# Altium project MICA-Glove-Carpus.PrjPcb
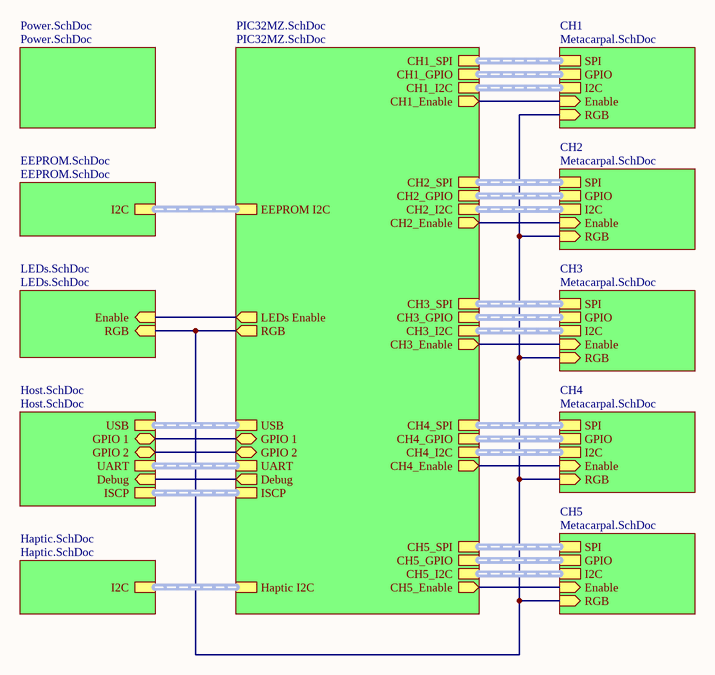
[diagram p0: Main.SchDoc]
Author: Seb Madgwick; Project: MICA Glove Carpus; Version: v1.0
8 sheets, 72 parts. Net scope: hierarchical (ports join the sheet entries above them; power ports are global).
Board file: MICA-Glove-Carpus.PcbDoc
Sheets:
  Main.SchDoc
    PIC32MZ.SchDoc = PIC32MZ.SchDoc
    Power.SchDoc = Power.SchDoc
    CH1 = Metacarpal.SchDoc
    EEPROM.SchDoc = EEPROM.SchDoc
    LEDs.SchDoc = LEDs.SchDoc
    Haptic.SchDoc = Haptic.SchDoc
    Host.SchDoc = Host.SchDoc
    CH2 = Metacarpal.SchDoc
    CH3 = Metacarpal.SchDoc
    CH4 = Metacarpal.SchDoc
    CH5 = Metacarpal.SchDoc

## Sheet Main.SchDoc
size A4; SheetNumber: 1; SheetTotal: 8

### Sub-sheets
CH1 = Metacarpal.SchDoc: I2C (harness I2C), SPI (harness SPI), GPIO (harness GPIO), RGB (in), Enable (in)
CH2 = Metacarpal.SchDoc: I2C (harness I2C), SPI (harness SPI), GPIO (harness GPIO), RGB (in), Enable (in)
CH3 = Metacarpal.SchDoc: I2C (harness I2C), SPI (harness SPI), GPIO (harness GPIO), RGB (in), Enable (in)
CH4 = Metacarpal.SchDoc: I2C (harness I2C), SPI (harness SPI), GPIO (harness GPIO), RGB (in), Enable (in)
CH5 = Metacarpal.SchDoc: I2C (harness I2C), SPI (harness SPI), GPIO (harness GPIO), RGB (in), Enable (in)
EEPROM.SchDoc = EEPROM.SchDoc: I2C (harness I2C)
Haptic.SchDoc = Haptic.SchDoc: I2C (harness I2C)
Host.SchDoc = Host.SchDoc: UART (harness UART), USB (harness USB), ISCP (harness ICSP), Debug (in), GPIO 1 (bidir), GPIO 2 (bidir)
LEDs.SchDoc = LEDs.SchDoc: RGB (in), Enable (in)
PIC32MZ.SchDoc = PIC32MZ.SchDoc: EEPROM I2C (harness I2C), Haptic I2C (harness I2C), CH1_SPI (harness SPI), CH1_GPIO (harness GPIO), CH1_I2C (harness I2C), CH2_SPI (harness SPI), CH2_GPIO (harness GPIO), CH2_I2C (harness I2C), CH3_SPI (harness SPI), CH3_GPIO (harness GPIO), CH3_I2C (harness I2C), CH4_SPI (harness SPI), CH4_GPIO (harness GPIO), CH4_I2C (harness I2C), CH5_SPI (harness SPI), CH5_GPIO (harness GPIO), CH5_I2C (harness I2C), UART (harness UART), USB (harness USB), ISCP (harness ICSP), RGB (out), LEDs Enable (out), CH1_Enable (out), CH2_Enable (out), CH5_Enable (out), CH4_Enable (out), CH3_Enable (out), Debug (out), GPIO 2 (bidir), GPIO 1 (bidir)
Power.SchDoc = Power.SchDoc: no entries

### Nets
CH1_Enable: sheet PIC32MZ.SchDoc/CH1_Enable, sheet CH1/Enable
CH2_Enable: sheet PIC32MZ.SchDoc/CH2_Enable, sheet CH2/Enable
CH3_Enable: sheet PIC32MZ.SchDoc/CH3_Enable, sheet CH3/Enable
CH4_Enable: sheet PIC32MZ.SchDoc/CH4_Enable, sheet CH4/Enable
CH5_Enable: sheet PIC32MZ.SchDoc/CH5_Enable, sheet CH5/Enable
Debug: sheet PIC32MZ.SchDoc/Debug, sheet Host.SchDoc/Debug
GPIO 1: sheet PIC32MZ.SchDoc/GPIO 1, sheet Host.SchDoc/GPIO 1
GPIO 2: sheet PIC32MZ.SchDoc/GPIO 2, sheet Host.SchDoc/GPIO 2
LEDs Enable: sheet PIC32MZ.SchDoc/LEDs Enable, sheet LEDs.SchDoc/Enable
RGB: sheet PIC32MZ.SchDoc/RGB, sheet CH1/RGB, sheet LEDs.SchDoc/RGB, sheet CH2/RGB, sheet CH3/RGB, sheet CH4/RGB, sheet CH5/RGB

### Buses and harness runs
harness sheet CH1/GPIO = sheet PIC32MZ.SchDoc/CH1_GPIO
harness sheet CH1/I2C = sheet PIC32MZ.SchDoc/CH1_I2C
harness sheet CH1/SPI = sheet PIC32MZ.SchDoc/CH1_SPI
harness sheet CH2/GPIO = sheet PIC32MZ.SchDoc/CH2_GPIO
harness sheet CH2/I2C = sheet PIC32MZ.SchDoc/CH2_I2C
harness sheet CH2/SPI = sheet PIC32MZ.SchDoc/CH2_SPI
harness sheet CH3/GPIO = sheet PIC32MZ.SchDoc/CH3_GPIO
harness sheet CH3/I2C = sheet PIC32MZ.SchDoc/CH3_I2C
harness sheet CH3/SPI = sheet PIC32MZ.SchDoc/CH3_SPI
harness sheet CH4/GPIO = sheet PIC32MZ.SchDoc/CH4_GPIO
harness sheet CH4/I2C = sheet PIC32MZ.SchDoc/CH4_I2C
harness sheet CH4/SPI = sheet PIC32MZ.SchDoc/CH4_SPI
harness sheet CH5/GPIO = sheet PIC32MZ.SchDoc/CH5_GPIO
harness sheet CH5/I2C = sheet PIC32MZ.SchDoc/CH5_I2C
harness sheet CH5/SPI = sheet PIC32MZ.SchDoc/CH5_SPI
harness sheet EEPROM.SchDoc/I2C = sheet PIC32MZ.SchDoc/EEPROM I2C
harness sheet Haptic.SchDoc/I2C = sheet PIC32MZ.SchDoc/Haptic I2C
harness sheet Host.SchDoc/ISCP = sheet PIC32MZ.SchDoc/ISCP
harness sheet Host.SchDoc/UART = sheet PIC32MZ.SchDoc/UART
harness sheet Host.SchDoc/USB = sheet PIC32MZ.SchDoc/USB

### Notes on the sheet
- TITLE
- SIZE
- A4
- VARIANT
- PROJECT
- SHEET
- VERSION
- OF
- AUTHOR
- DATE

## Sheet PIC32MZ.SchDoc
size A3; SheetNumber: 3; SheetTotal: 8
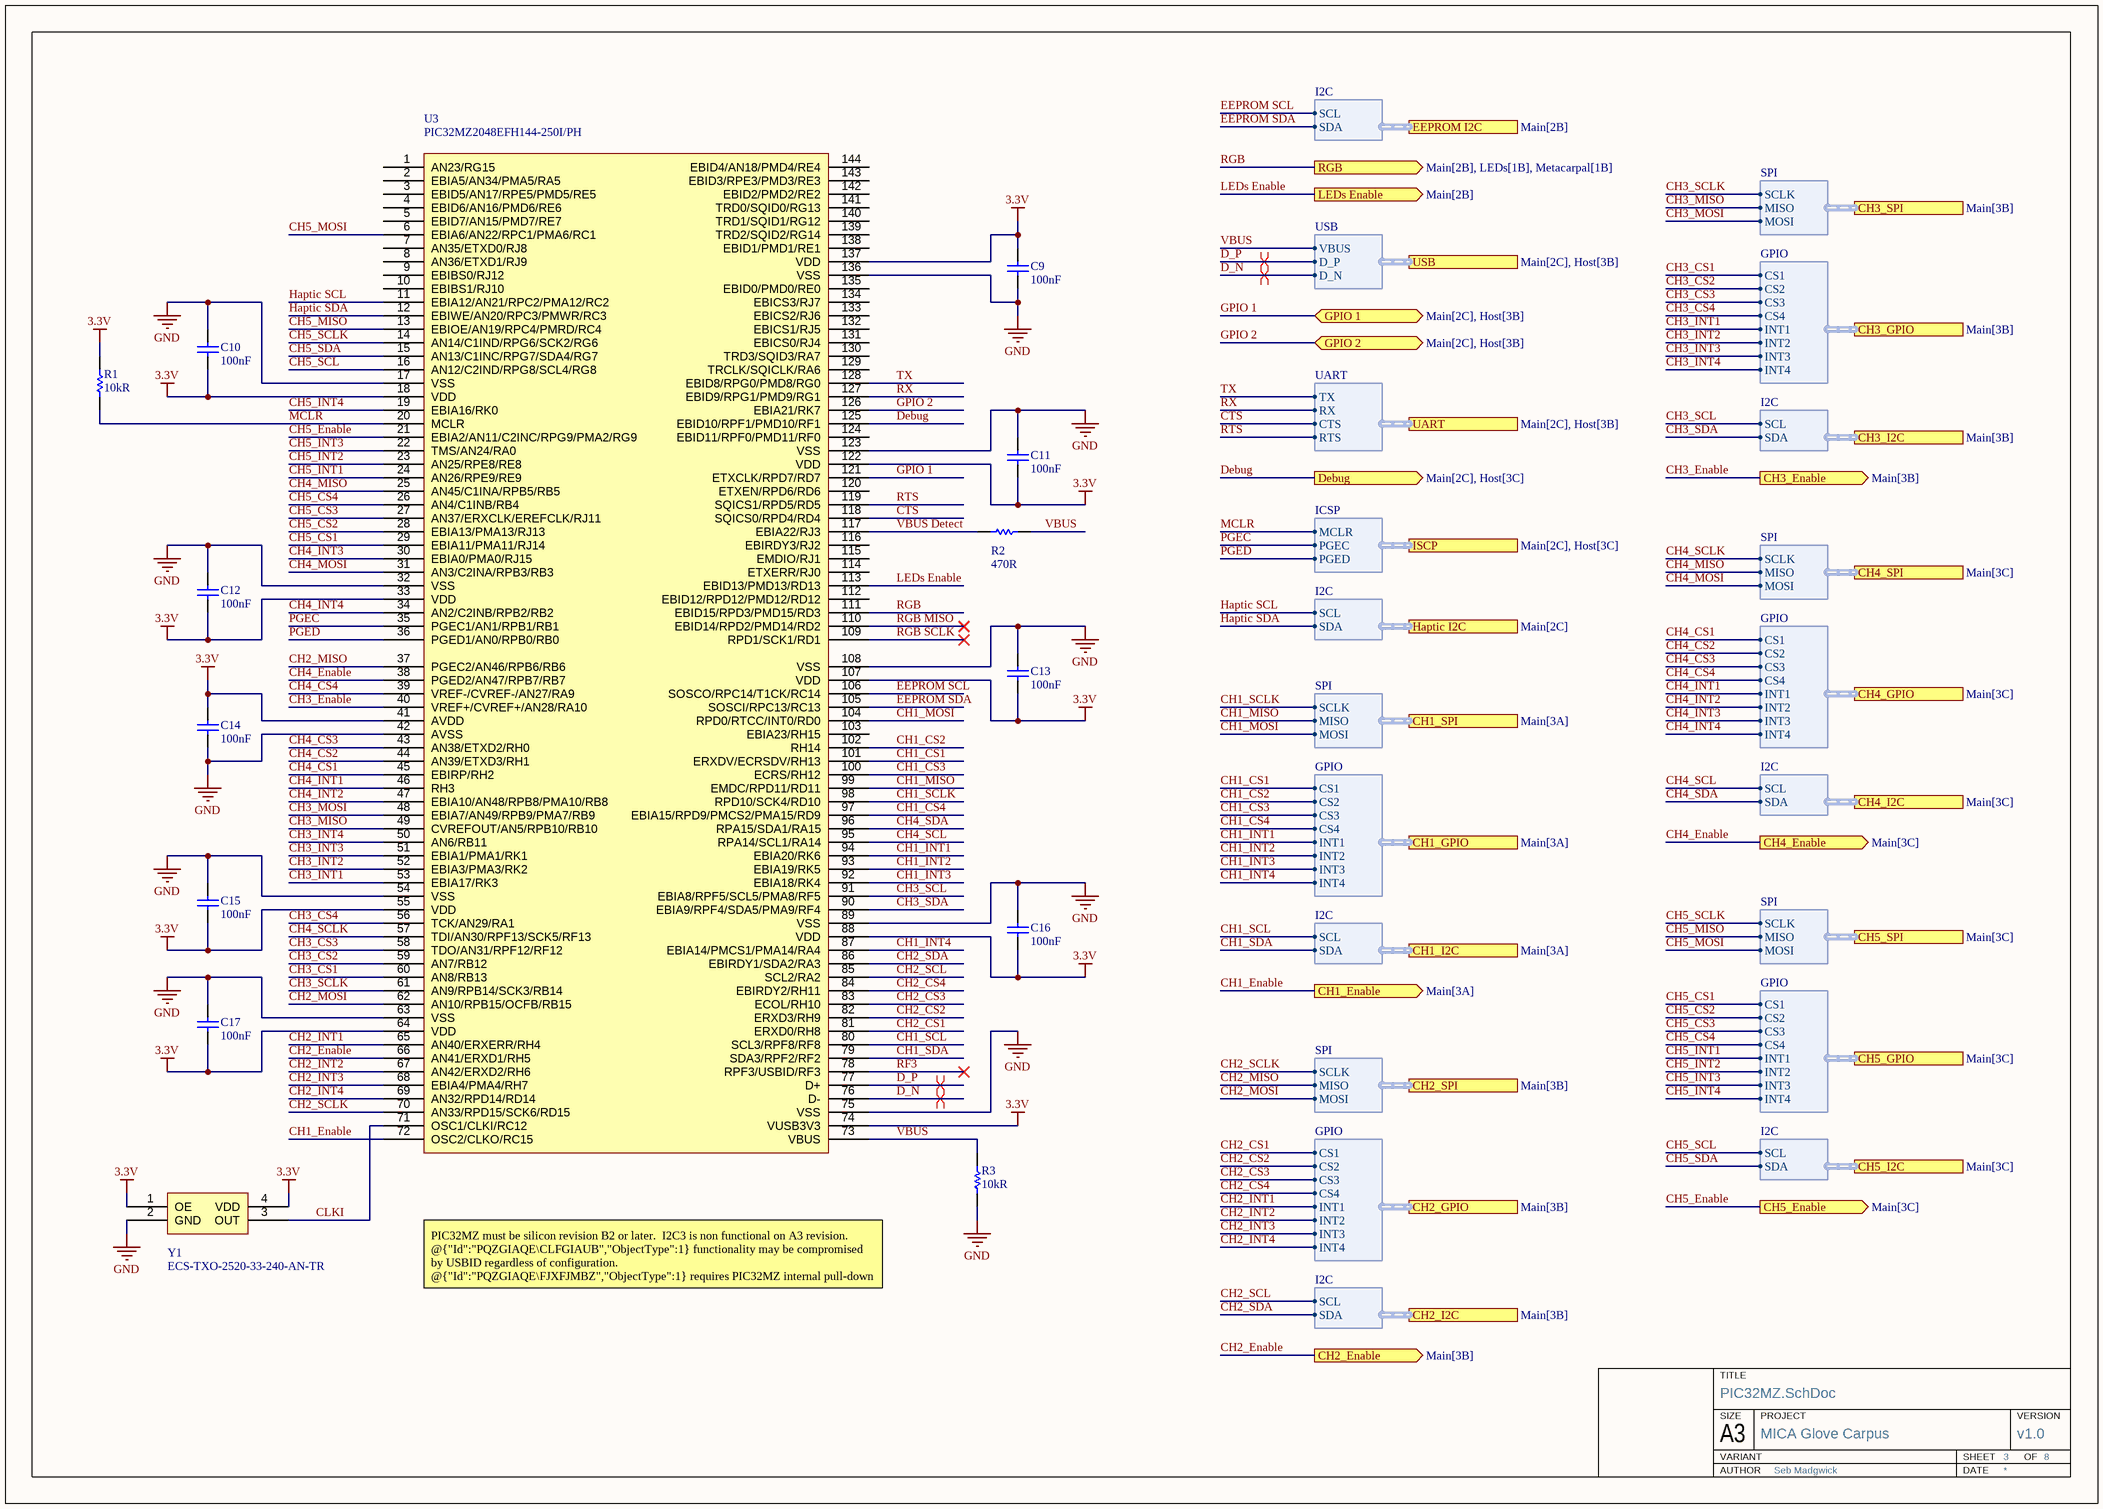
[diagram p1: PIC32MZ.SchDoc]

### Parts
C9  100nF  [Capacitor 0402]
C10  100nF  [Capacitor 0402]
C11  100nF  [Capacitor 0402]
C12  100nF  [Capacitor 0402]
C13  100nF  [Capacitor 0402]
C14  100nF  [Capacitor 0402]
C15  100nF  [Capacitor 0402]
C16  100nF  [Capacitor 0402]
C17  100nF  [Capacitor 0402]
R1  10kR  [Resistor 0402]
R2  470R  [Resistor 0402]
R3  10kR  [Resistor 0402]
U3  PIC32MZ2048EFH144-250I/PH  [TQFP-144 0.4mm]
Y1  ECS-TXO-2520-33-240-AN-TR  [ECS 2x2.5mm]

### Ports
CH1_Enable (out, see Main[3A]), CH1_GPIO (harness GPIO, see Main[3A]), CH1_I2C (harness I2C, see Main[3A]), CH1_SPI (harness SPI, see Main[3A]), CH2_Enable (out, see Main[3B]), CH2_GPIO (harness GPIO, see Main[3B]), CH2_I2C (harness I2C, see Main[3B]), CH2_SPI (harness SPI, see Main[3B]), CH3_Enable (out, see Main[3B]), CH3_GPIO (harness GPIO, see Main[3B]), CH3_I2C (harness I2C, see Main[3B]), CH3_SPI (harness SPI, see Main[3B]), CH4_Enable (out, see Main[3C]), CH4_GPIO (harness GPIO, see Main[3C]), CH4_I2C (harness I2C, see Main[3C]), CH4_SPI (harness SPI, see Main[3C]), CH5_Enable (out, see Main[3C]), CH5_GPIO (harness GPIO, see Main[3C]), CH5_I2C (harness I2C, see Main[3C]), CH5_SPI (harness SPI, see Main[3C]), Debug (out, see Main[2C], Host[3C]), EEPROM I2C (harness I2C, see Main[2B]), GPIO 1 (bidir, see Main[2C], Host[3B]), GPIO 2 (bidir, see Main[2C], Host[3B]), Haptic I2C (harness I2C, see Main[2C]), ISCP (harness ICSP, see Main[2C], Host[3C]), LEDs Enable (out, see Main[2B]), RGB (out, see Main[2B], LEDs[1B], Metacarpal[1B]), UART (harness UART, see Main[2C], Host[3B]), USB (harness USB, see Main[2C], Host[3B])

### Harnesses
I2C: SCL, SDA
SPI: SCLK, MISO, MOSI
GPIO: CS1, CS2, CS3, CS4, INT1, INT2, INT3, INT4
UART: TX, RX, CTS, RTS
USB: VBUS, D_P, D_N
ICSP: MCLR, PGEC, PGED

### Nets
3.3V: C9.2 C10.1 C11.1 C12.1 C13.1 C14.2 C15.1 C16.1 C17.1 R1.2 U3.18(VDD) U3.33(VDD) U3.41(AVDD) U3.55(VDD) U3.64(VDD) U3.74(VUSB3V3) U3.88(VDD) U3.107(VDD) U3.122(VDD) U3.137(VDD) Y1.1(OE) Y1.4(VDD)
GND: C9.1 C10.2 C11.2 C12.2 C13.2 C14.1 C15.2 C16.2 C17.2 R3.1 U3.17(VSS) U3.32(VSS) U3.42(AVSS) U3.54(VSS) U3.63(VSS) U3.75(VSS) U3.89(VSS) U3.108(VSS) U3.123(VSS) U3.136(VSS) Y1.2(GND)
CH1_CS1: U3.101(ERXDV/ECRSDV/RH13) ; port CH1_GPIO.CS1
CH1_CS2: U3.102(RH14) ; port CH1_GPIO.CS2
CH1_CS3: U3.100(ECRS/RH12) ; port CH1_GPIO.CS3
CH1_CS4: U3.97(EBIA15/RPD9/PMCS2/PMA15/RD9) ; port CH1_GPIO.CS4
CH1_Enable: U3.72(OSC2/CLKO/RC15) ; port CH1_Enable
CH1_INT1: U3.94(EBIA20/RK6) ; port CH1_GPIO.INT1
CH1_INT2: U3.93(EBIA19/RK5) ; port CH1_GPIO.INT2
CH1_INT3: U3.92(EBIA18/RK4) ; port CH1_GPIO.INT3
CH1_INT4: U3.87(EBIA14/PMCS1/PMA14/RA4) ; port CH1_GPIO.INT4
CH1_MISO: U3.99(EMDC/RPD11/RD11) ; port CH1_SPI.MISO
CH1_MOSI: U3.104(RPD0/RTCC/INT0/RD0) ; port CH1_SPI.MOSI
CH1_SCL: U3.80(SCL3/RPF8/RF8) ; port CH1_I2C.SCL
CH1_SCLK: U3.98(RPD10/SCK4/RD10) ; port CH1_SPI.SCLK
CH1_SDA: U3.79(SDA3/RPF2/RF2)
CH2_CS1: U3.81(ERXD0/RH8) ; port CH2_GPIO.CS1
CH2_CS2: U3.82(ERXD3/RH9) ; port CH2_GPIO.CS2
CH2_CS3: U3.83(ECOL/RH10) ; port CH2_GPIO.CS3
CH2_CS4: U3.84(EBIRDY2/RH11) ; port CH2_GPIO.CS4
CH2_Enable: U3.66(AN41/ERXD1/RH5) ; port CH2_Enable
CH2_INT1: U3.65(AN40/ERXERR/RH4) ; port CH2_GPIO.INT1
CH2_INT2: U3.67(AN42/ERXD2/RH6) ; port CH2_GPIO.INT2
CH2_INT3: U3.68(EBIA4/PMA4/RH7) ; port CH2_GPIO.INT3
CH2_INT4: U3.69(AN32/RPD14/RD14) ; port CH2_GPIO.INT4
CH2_MISO: U3.37(PGEC2/AN46/RPB6/RB6) ; port CH2_SPI.MISO
CH2_MOSI: U3.62(AN10/RPB15/OCFB/RB15) ; port CH2_SPI.MOSI
CH2_SCL: U3.85(SCL2/RA2) ; port CH2_I2C.SCL
CH2_SCLK: U3.70(AN33/RPD15/SCK6/RD15) ; port CH2_SPI.SCLK
CH2_SDA: U3.86(EBIRDY1/SDA2/RA3)
CH3_CS1: U3.60(AN8/RB13) ; port CH3_GPIO.CS1
CH3_CS2: U3.59(AN7/RB12) ; port CH3_GPIO.CS2
CH3_CS3: U3.58(TDO/AN31/RPF12/RF12) ; port CH3_GPIO.CS3
CH3_CS4: U3.56(TCK/AN29/RA1) ; port CH3_GPIO.CS4
CH3_Enable: U3.40(VREF+/CVREF+/AN28/RA10) ; port CH3_Enable
CH3_INT1: U3.53(EBIA17/RK3) ; port CH3_GPIO.INT1
CH3_INT2: U3.52(EBIA3/PMA3/RK2) ; port CH3_GPIO.INT2
CH3_INT3: U3.51(EBIA1/PMA1/RK1) ; port CH3_GPIO.INT3
CH3_INT4: U3.50(AN6/RB11) ; port CH3_GPIO.INT4
CH3_MISO: U3.49(CVREFOUT/AN5/RPB10/RB10) ; port CH3_SPI.MISO
CH3_MOSI: U3.48(EBIA7/AN49/RPB9/PMA7/RB9) ; port CH3_SPI.MOSI
CH3_SCL: U3.91(EBIA8/RPF5/SCL5/PMA8/RF5) ; port CH3_I2C.SCL
CH3_SCLK: U3.61(AN9/RPB14/SCK3/RB14) ; port CH3_SPI.SCLK
CH3_SDA: U3.90(EBIA9/RPF4/SDA5/PMA9/RF4)
CH4_CS1: U3.45(EBIRP/RH2) ; port CH4_GPIO.CS1
CH4_CS2: U3.44(AN39/ETXD3/RH1) ; port CH4_GPIO.CS2
CH4_CS3: U3.43(AN38/ETXD2/RH0) ; port CH4_GPIO.CS3
CH4_CS4: U3.39(VREF-/CVREF-/AN27/RA9) ; port CH4_GPIO.CS4
CH4_Enable: U3.38(PGED2/AN47/RPB7/RB7) ; port CH4_Enable
CH4_INT1: U3.46(RH3) ; port CH4_GPIO.INT1
CH4_INT2: U3.47(EBIA10/AN48/RPB8/PMA10/RB8) ; port CH4_GPIO.INT2
CH4_INT3: U3.30(EBIA0/PMA0/RJ15) ; port CH4_GPIO.INT3
CH4_INT4: U3.34(AN2/C2INB/RPB2/RB2) ; port CH4_GPIO.INT4
CH4_MISO: U3.25(AN45/C1INA/RPB5/RB5) ; port CH4_SPI.MISO
CH4_MOSI: U3.31(AN3/C2INA/RPB3/RB3) ; port CH4_SPI.MOSI
CH4_SCL: U3.95(RPA14/SCL1/RA14) ; port CH4_I2C.SCL
CH4_SCLK: U3.57(TDI/AN30/RPF13/SCK5/RF13) ; port CH4_SPI.SCLK
CH4_SDA: U3.96(RPA15/SDA1/RA15)
CH5_CS1: U3.29(EBIA11/PMA11/RJ14) ; port CH5_GPIO.CS1
CH5_CS2: U3.28(EBIA13/PMA13/RJ13) ; port CH5_GPIO.CS2
CH5_CS3: U3.27(AN37/ERXCLK/EREFCLK/RJ11) ; port CH5_GPIO.CS3
CH5_CS4: U3.26(AN4/C1INB/RB4) ; port CH5_GPIO.CS4
CH5_Enable: U3.21(EBIA2/AN11/C2INC/RPG9/PMA2/RG9) ; port CH5_Enable
CH5_INT1: U3.24(AN26/RPE9/RE9) ; port CH5_GPIO.INT1
CH5_INT2: U3.23(AN25/RPE8/RE8) ; port CH5_GPIO.INT2
CH5_INT3: U3.22(TMS/AN24/RA0) ; port CH5_GPIO.INT3
CH5_INT4: U3.19(EBIA16/RK0) ; port CH5_GPIO.INT4
CH5_MISO: U3.13(EBIOE/AN19/RPC4/PMRD/RC4) ; port CH5_SPI.MISO
CH5_MOSI: U3.6(EBIA6/AN22/RPC1/PMA6/RC1) ; port CH5_SPI.MOSI
CH5_SCL: U3.16(AN12/C2IND/RPG8/SCL4/RG8) ; port CH5_I2C.SCL
CH5_SCLK: U3.14(AN14/C1IND/RPG6/SCK2/RG6) ; port CH5_SPI.SCLK
CH5_SDA: U3.15(AN13/C1INC/RPG7/SDA4/RG7)
CLKI: U3.71(OSC1/CLKI/RC12) Y1.3(OUT)
CTS: U3.118(SQICS0/RPD4/RD4) ; port UART.CTS
D_N: U3.76(D-) ; port USB.D_N
D_P: U3.77(D+) ; port USB.D_P
Debug: U3.125(EBID10/RPF1/PMD10/RF1) ; port Debug
EEPROM SCL: U3.106(SOSCO/RPC14/T1CK/RC14) ; port EEPROM I2C.SCL
EEPROM SDA: U3.105(SOSCI/RPC13/RC13)
GPIO 1: U3.121(ETXCLK/RPD7/RD7) ; port GPIO 1
GPIO 2: U3.126(EBIA21/RK7) ; port GPIO 2
Haptic SCL: U3.11(EBIA12/AN21/RPC2/PMA12/RC2) ; port Haptic I2C.SCL
Haptic SDA: U3.12(EBIWE/AN20/RPC3/PMWR/RC3)
LEDs Enable: U3.113(EBID13/PMD13/RD13) ; port LEDs Enable
MCLR: R1.1 U3.20(MCLR) ; port ISCP.MCLR
PGEC: U3.35(PGEC1/AN1/RPB1/RB1) ; port ISCP.PGEC
PGED: U3.36(PGED1/AN0/RPB0/RB0) ; port ISCP.PGED
RF3: U3.78(RPF3/USBID/RF3)
RGB: U3.111(EBID15/RPD3/PMD15/RD3) ; port RGB
RGB MISO: U3.110(EBID14/RPD2/PMD14/RD2)
RGB SCLK: U3.109(RPD1/SCK1/RD1)
RTS: U3.119(SQICS1/RPD5/RD5) ; port UART.RTS
RX: U3.127(EBID9/RPG1/PMD9/RG1) ; port UART.RX
TX: U3.128(EBID8/RPG0/PMD8/RG0) ; port UART.TX
VBUS: R2.1 R3.2 U3.73(VBUS) ; port USB.VBUS
VBUS Detect: R2.2 U3.117(EBIA22/RJ3)

Not connected (* = marked no-connect by the designer): U3 1(AN23/RG15) 2(EBIA5/AN34/PMA5/RA5) 3(EBID5/AN17/RPE5/PMD5/RE5) 4(EBID6/AN16/PMD6/RE6) 5(EBID7/AN15/PMD7/RE7) 7(AN35/ETXD0/RJ8) 8(AN36/ETXD1/RJ9) 9(EBIBS0/RJ12) 10(EBIBS1/RJ10) 103(EBIA23/RH15) 112(EBID12/RPD12/PMD12/RD12) 114(ETXERR/RJ0) 115(EMDIO/RJ1) 116(EBIRDY3/RJ2) 120(ETXEN/RPD6/RD6) 124(EBID11/RPF0/PMD11/RF0) 129(TRCLK/SQICLK/RA6) 130(TRD3/SQID3/RA7) 131(EBICS0/RJ4) 132(EBICS1/RJ5) 133(EBICS2/RJ6) 134(EBICS3/RJ7) 135(EBID0/PMD0/RE0) 138(EBID1/PMD1/RE1) 139(TRD2/SQID2/RG14) 140(TRD1/SQID1/RG12) 141(TRD0/SQID0/RG13) 142(EBID2/PMD2/RE2) 143(EBID3/RPE3/PMD3/RE3) 144(EBID4/AN18/PMD4/RE4)

### Layout directives
differential pair: D_N, D_P

### Notes on the sheet
- PIC32MZ must be silicon revision B2 or later.  I2C3 is non functional on A3 revision.
  @{"Id":"PQZGIAQE\CLFGIAUB","ObjectType":1} functionality may be compromised by USBID regardless of configuration.
  @{"Id":"PQZGIAQE\FJXFJMBZ","ObjectType":1} requires PIC32MZ internal pull-down to ensure @{"Id":"QSPHDPUG\XVWCFEXP","ObjectType":1} is idle low.
  @{"Id":"PQZGIAQE\AZLPJNPW","ObjectType":1} will output SCK1 regardless of PPS configuration.
- TITLE
- SIZE
- A3
- VARIANT
- PROJECT
- SHEET
- VERSION
- OF
- AUTHOR
- DATE

### Library data of the parts
C9-C17 = Capacitor
R1-R3 = Resistor
Y1 = Oscillator

## Sheet Power.SchDoc
size A4; SheetNumber: 2; SheetTotal: 8
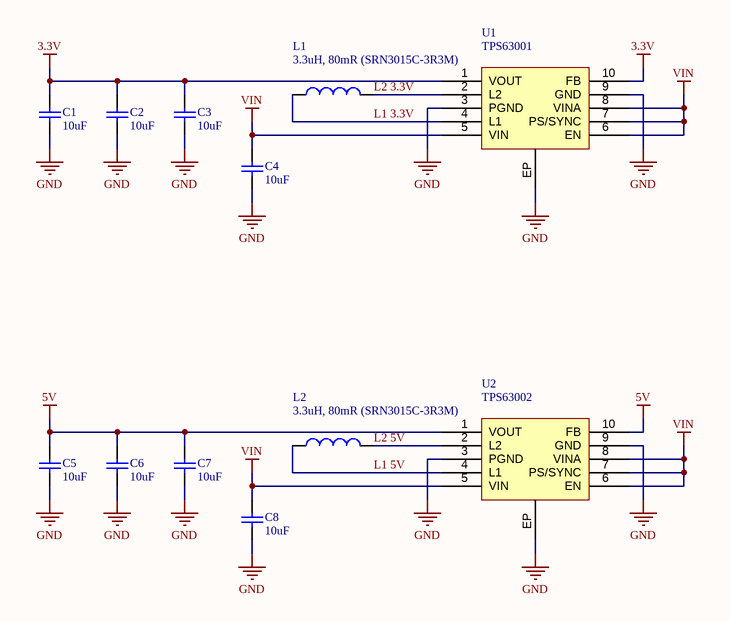
[diagram p2: Power.SchDoc]

### Parts
C1  10uF  [Capacitor 0402]
C2  10uF  [Capacitor 0402]
C3  10uF  [Capacitor 0402]
C4  10uF  [Capacitor 0402]
C5  10uF  [Capacitor 0402]
C6  10uF  [Capacitor 0402]
C7  10uF  [Capacitor 0402]
C8  10uF  [Capacitor 0402]
L1  3.3uH, 80mR (SRN3015C-3R3M)  [SRN3015C]
L2  3.3uH, 80mR (SRN3015C-3R3M)  [SRN3015C]
U1  TPS63001  [WSON-10]
U2  TPS63002  [WSON-10]

### Nets
3.3V: C1.2 C2.2 C3.2 U1.1(VOUT) U1.10(FB)
5V: C5.2 C6.2 C7.2 U2.1(VOUT) U2.10(FB)
GND: C1.1 C2.1 C3.1 C4.1 C5.1 C6.1 C7.1 C8.1 U1.3(PGND) U1.9(GND) U1.EP U2.3(PGND) U2.9(GND) U2.EP
VIN: C4.2 C8.2 U1.5(VIN) U1.6(EN) U1.7(PS/SYNC) U1.8(VINA) U2.5(VIN) U2.6(EN) U2.7(PS/SYNC) U2.8(VINA)
L1 3.3V: L1.1 U1.4(L1)
L1 5V: L2.1 U2.4(L1)
L2 3.3V: L1.2 U1.2(L2)
L2 5V: L2.2 U2.2(L2)

### Notes on the sheet
- TITLE
- SIZE
- A4
- VARIANT
- PROJECT
- SHEET
- VERSION
- OF
- AUTHOR
- DATE

### Library data of the parts
C1-C8 = Capacitor
L1 L2 = Inductor
U1 U2 = TPS630XX

## Sheet Metacarpal.SchDoc
size A4; SheetNumber: 8; SheetTotal: 8
Used 5 times, as channels CH1, CH2, CH3, CH4, CH5. Parts and nets are listed once, with the designators drawn on the sheet.
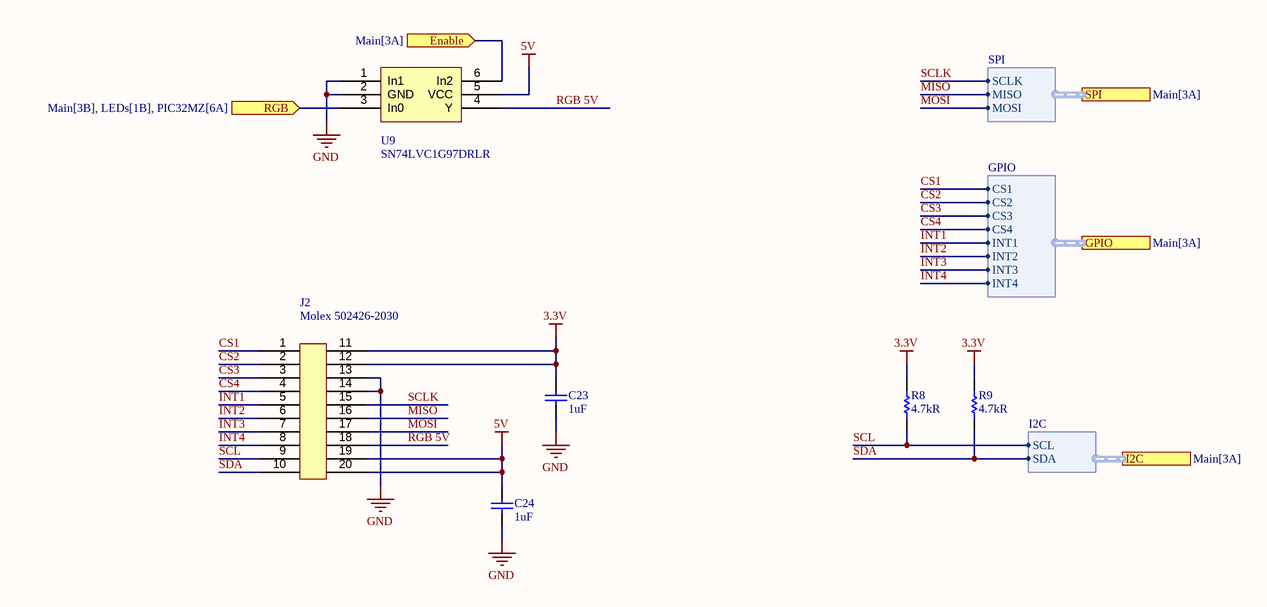
[diagram p3: Metacarpal.SchDoc]

### Parts
C23  1uF  [Capacitor 0402]
C24  1uF  [Capacitor 0402]
J2  Molex 502426-2030  [Molex 502426-2030]
R8  4.7kR  [Resistor 0402]
R9  4.7kR  [Resistor 0402]
U9  SN74LVC1G97DRLR  [SOT-666]

### Ports
Enable (in, see Main[3A]), GPIO (harness GPIO, see Main[3A]), I2C (harness I2C, see Main[3A]), RGB (in, see Main[3B], LEDs[1B], PIC32MZ[6A]), SPI (harness SPI, see Main[3A])

### Harnesses
SPI: SCLK, MISO, MOSI
GPIO: CS1, CS2, CS3, CS4, INT1, INT2, INT3, INT4
I2C: SCL, SDA

### Nets
3.3V: C23.2 J2.11 J2.12 R8.2 R9.2
5V: C24.2 J2.19 J2.20 U9.5(VCC)
GND: C23.1 C24.1 J2.13 J2.14 U9.1(In1) U9.2(GND)
CS1: J2.1 ; port GPIO.CS1
CS2: J2.2 ; port GPIO.CS2
CS3: J2.3 ; port GPIO.CS3
CS4: J2.4 ; port GPIO.CS4
Enable: U9.6(In2) ; port Enable
INT1: J2.5 ; port GPIO.INT1
INT2: J2.6 ; port GPIO.INT2
INT3: J2.7 ; port GPIO.INT3
INT4: J2.8 ; port GPIO.INT4
MISO: J2.16 ; port SPI.MISO
MOSI: J2.17 ; port SPI.MOSI
RGB: U9.3(In0) ; port RGB
RGB 5V: J2.18 U9.4(Y)
SCL: J2.9 R8.1 ; port I2C.SCL
SCLK: J2.15 ; port SPI.SCLK
SDA: J2.10 R9.1

### Channels
CH1: designators C23=CH1_C23 C24=CH1_C24 J2=CH1_J2 R8=CH1_R8 R9=CH1_R9 U9=CH1_U9; ports Enable=CH1_Enable RGB=RGB
CH2: designators C23=CH2_C23 C24=CH2_C24 J2=CH2_J2 R8=CH2_R8 R9=CH2_R9 U9=CH2_U9; ports Enable=CH2_Enable RGB=RGB
CH3: designators C23=CH3_C23 C24=CH3_C24 J2=CH3_J2 R8=CH3_R8 R9=CH3_R9 U9=CH3_U9; ports Enable=CH3_Enable RGB=RGB
CH4: designators C23=CH4_C23 C24=CH4_C24 J2=CH4_J2 R8=CH4_R8 R9=CH4_R9 U9=CH4_U9; ports Enable=CH4_Enable RGB=RGB
CH5: designators C23=CH5_C23 C24=CH5_C24 J2=CH5_J2 R8=CH5_R8 R9=CH5_R9 U9=CH5_U9; ports Enable=CH5_Enable RGB=RGB

### Notes on the sheet
- TITLE
- SIZE
- A4
- VARIANT
- PROJECT
- SHEET
- VERSION
- OF
- AUTHOR
- DATE

### Library data of the parts
C23 C24 = Capacitor
R8 R9 = Resistor

## Sheet EEPROM.SchDoc
size A4; SheetNumber: 4; SheetTotal: 8
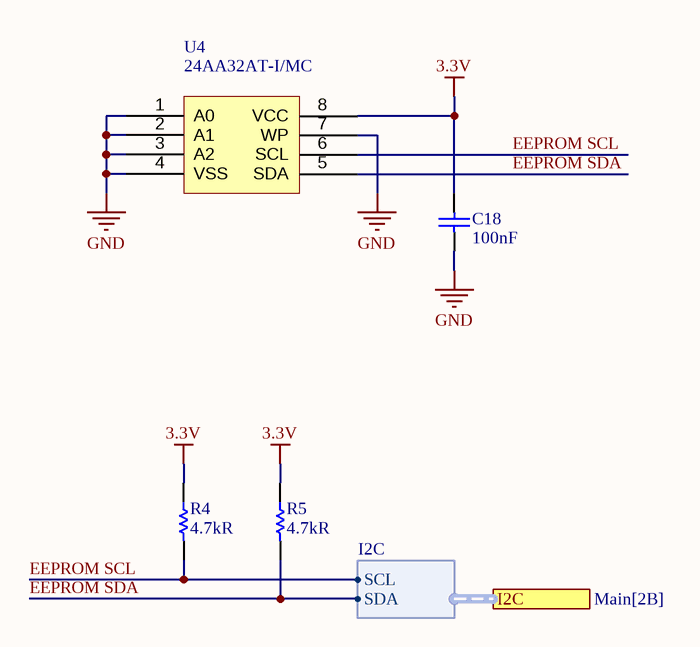
[diagram p4: EEPROM.SchDoc]

### Parts
C18  100nF  [Capacitor 0402]
R4  4.7kR  [Resistor 0402]
R5  4.7kR  [Resistor 0402]
U4  24AA32AT-I/MC  [TDFN-8 2x3mm]

### Ports
I2C (harness I2C, see Main[2B])

### Harnesses
I2C: SCL, SDA

### Nets
3.3V: C18.2 R4.2 R5.2 U4.8(VCC)
GND: C18.1 U4.1(A0) U4.2(A1) U4.3(A2) U4.4(VSS) U4.7(WP)
EEPROM SCL: R4.1 U4.6(SCL) ; port I2C.SCL
EEPROM SDA: R5.1 U4.5(SDA)

### Notes on the sheet
- TITLE
- SIZE
- A4
- VARIANT
- PROJECT
- SHEET
- VERSION
- OF
- AUTHOR
- DATE

### Library data of the parts
C18 = Capacitor
R4 R5 = Resistor
U4 = 24AA32A

## Sheet LEDs.SchDoc
size A4; SheetNumber: 5; SheetTotal: 8
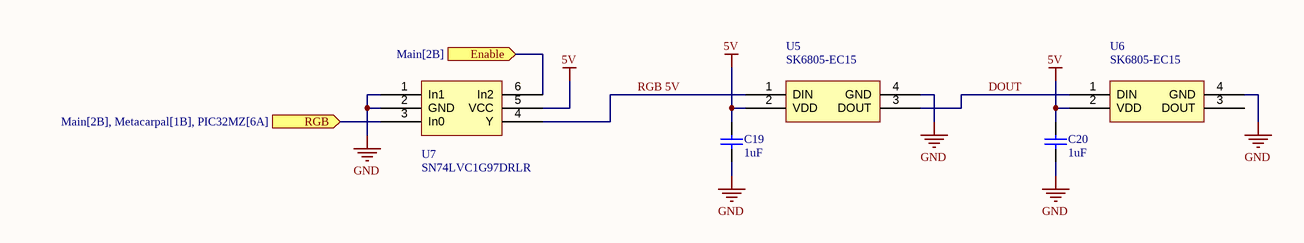
[diagram p5: LEDs.SchDoc]

### Parts
C19  1uF  [Capacitor 0402]
C20  1uF  [Capacitor 0402]
U5  SK6805-EC15  [SK6805-EC15]
U6  SK6805-EC15  [SK6805-EC15]
U7  SN74LVC1G97DRLR  [SOT-666]

### Ports
Enable (in, see Main[2B]), RGB (in, see Main[2B], Metacarpal[1B], PIC32MZ[6A])

### Nets
5V: C19.2 C20.2 U5.2(VDD) U6.2(VDD) U7.5(VCC)
GND: C19.1 C20.1 U5.4(GND) U6.4(GND) U7.1(In1) U7.2(GND)
DOUT: U5.3(DOUT) U6.1(DIN)
LEDs Enable: U7.6(In2) ; port Enable
RGB: U7.3(In0) ; port RGB
RGB 5V: U5.1(DIN) U7.4(Y)

Not connected (* = marked no-connect by the designer): U6 3(DOUT)

### Notes on the sheet
- TITLE
- SIZE
- A4
- VARIANT
- PROJECT
- SHEET
- VERSION
- OF
- AUTHOR
- DATE

### Library data of the parts
C19 C20 = Capacitor

## Sheet Haptic.SchDoc
size A4; SheetNumber: 7; SheetTotal: 8
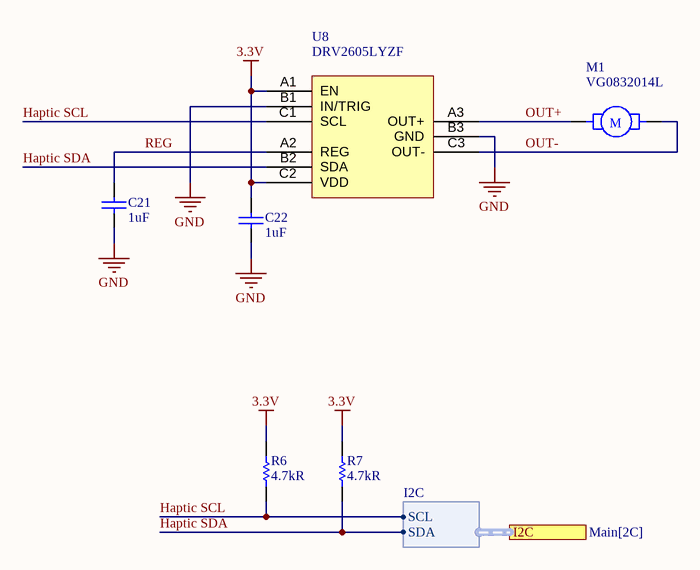
[diagram p6: Haptic.SchDoc]

### Parts
C21  1uF  [Capacitor 0402]
C22  1uF  [Capacitor 0402]
M1  VG0832014L  [VG0832014L]
R6  4.7kR  [Resistor 0402]
R7  4.7kR  [Resistor 0402]
U8  DRV2605LYZF  [DRV2605LYZF]

### Ports
I2C (harness I2C, see Main[2C])

### Harnesses
I2C: SCL, SDA

### Nets
3.3V: C22.2 R6.2 R7.2 U8.A1(EN) U8.C2(VDD)
GND: C21.1 C22.1 U8.B1(IN/TRIG) U8.B3(GND)
Haptic SCL: R6.1 U8.C1(SCL) ; port I2C.SCL
Haptic SDA: R7.1 U8.B2(SDA)
OUT+: M1.1 U8.A3(OUT+)
OUT-: M1.2 U8.C3(OUT-)
REG: C21.2 U8.A2(REG)

### Notes on the sheet
- TITLE
- SIZE
- A4
- VARIANT
- PROJECT
- SHEET
- VERSION
- OF
- AUTHOR
- DATE
- (in symbol VG0832014L) M

### Library data of the parts
C21 C22 = Capacitor
R6 R7 = Resistor

## Sheet Host.SchDoc
size A4; SheetNumber: 6; SheetTotal: 8
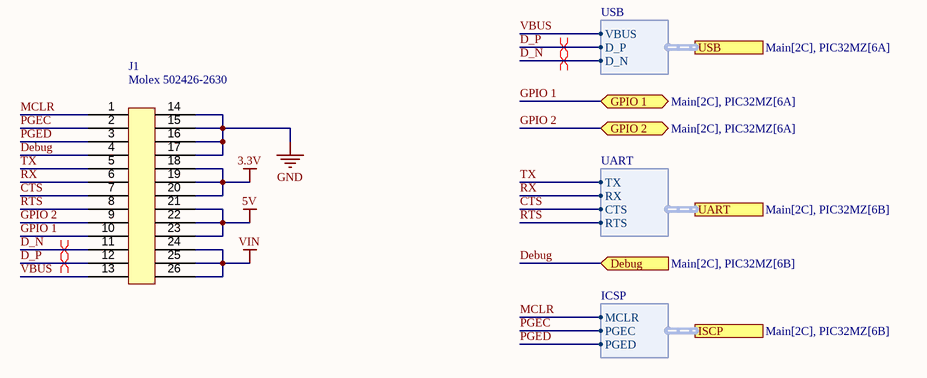
[diagram p7: Host.SchDoc]

### Parts
J1  Molex 502426-2630  [Molex 502426-2630]

### Ports
Debug (in, see Main[2C], PIC32MZ[6B]), GPIO 1 (bidir, see Main[2C], PIC32MZ[6A]), GPIO 2 (bidir, see Main[2C], PIC32MZ[6A]), ISCP (harness ICSP, see Main[2C], PIC32MZ[6B]), UART (harness UART, see Main[2C], PIC32MZ[6B]), USB (harness USB, see Main[2C], PIC32MZ[6A])

### Harnesses
UART: TX, RX, CTS, RTS
USB: VBUS, D_P, D_N
ICSP: MCLR, PGEC, PGED

### Nets
3.3V: J1.18 J1.19 J1.20
5V: J1.21 J1.22 J1.23
GND: J1.14 J1.15 J1.16 J1.17
VIN: J1.24 J1.25 J1.26
CTS: J1.7 ; port UART.CTS
D_N: J1.11 ; port USB.D_N
D_P: J1.12 ; port USB.D_P
Debug: J1.4 ; port Debug
GPIO 1: J1.10 ; port GPIO 1
GPIO 2: J1.9 ; port GPIO 2
MCLR: J1.1 ; port ISCP.MCLR
PGEC: J1.2 ; port ISCP.PGEC
PGED: J1.3 ; port ISCP.PGED
RTS: J1.8 ; port UART.RTS
RX: J1.6 ; port UART.RX
TX: J1.5 ; port UART.TX
VBUS: J1.13 ; port USB.VBUS

### Layout directives
differential pair: D_N, D_P

### Notes on the sheet
- TITLE
- SIZE
- A4
- VARIANT
- PROJECT
- SHEET
- VERSION
- OF
- AUTHOR
- DATE

## Nets that join several sheets
3.3V: PIC32MZ (22 pins), Power (5 pins), CH1 (5 pins), EEPROM (C18.2 R4.2 R5.2 U4.8), Haptic (5 pins), Host (J1.18 J1.19 J1.20), CH2 (5 pins), CH3 (5 pins), CH4 (5 pins), CH5 (5 pins)
5V: Power (5 pins), CH1 (CH1_C24.2 CH1_J2.19 CH1_J2.20 CH1_U9.5), LEDs (5 pins), Host (J1.21 J1.22 J1.23), CH2 (CH2_C24.2 CH2_J2.19 CH2_J2.20 CH2_U9.5), CH3 (CH3_C24.2 CH3_J2.19 CH3_J2.20 CH3_U9.5), CH4 (CH4_C24.2 CH4_J2.19 CH4_J2.20 CH4_U9.5), CH5 (CH5_C24.2 CH5_J2.19 CH5_J2.20 CH5_U9.5)
GND: PIC32MZ (21 pins), Power (14 pins), CH1 (6 pins), EEPROM (6 pins), LEDs (6 pins), Haptic (C21.1 C22.1 U8.B1 U8.B3), Host (J1.14 J1.15 J1.16 J1.17), CH2 (6 pins), CH3 (6 pins), CH4 (6 pins), CH5 (6 pins)
VIN: Power (10 pins), Host (J1.24 J1.25 J1.26)
CH1_CS1: PIC32MZ (U3.101), CH1 (CH1_J2.1)
CH1_CS2: PIC32MZ (U3.102), CH1 (CH1_J2.2)
CH1_CS3: PIC32MZ (U3.100), CH1 (CH1_J2.3)
CH1_CS4: PIC32MZ (U3.97), CH1 (CH1_J2.4)
CH1_Enable: PIC32MZ (U3.72), CH1 (CH1_U9.6)
CH1_INT1: PIC32MZ (U3.94), CH1 (CH1_J2.5)
CH1_INT2: PIC32MZ (U3.93), CH1 (CH1_J2.6)
CH1_INT3: PIC32MZ (U3.92), CH1 (CH1_J2.7)
CH1_INT4: PIC32MZ (U3.87), CH1 (CH1_J2.8)
CH1_MISO: PIC32MZ (U3.99), CH1 (CH1_J2.16)
CH1_MOSI: PIC32MZ (U3.104), CH1 (CH1_J2.17)
CH1_SCL: PIC32MZ (U3.80), CH1 (CH1_J2.9 CH1_R8.1)
CH1_SCLK: PIC32MZ (U3.98), CH1 (CH1_J2.15)
CH2_CS1: PIC32MZ (U3.81), CH2 (CH2_J2.1)
CH2_CS2: PIC32MZ (U3.82), CH2 (CH2_J2.2)
CH2_CS3: PIC32MZ (U3.83), CH2 (CH2_J2.3)
CH2_CS4: PIC32MZ (U3.84), CH2 (CH2_J2.4)
CH2_Enable: PIC32MZ (U3.66), CH2 (CH2_U9.6)
CH2_INT1: PIC32MZ (U3.65), CH2 (CH2_J2.5)
CH2_INT2: PIC32MZ (U3.67), CH2 (CH2_J2.6)
CH2_INT3: PIC32MZ (U3.68), CH2 (CH2_J2.7)
CH2_INT4: PIC32MZ (U3.69), CH2 (CH2_J2.8)
CH2_MISO: PIC32MZ (U3.37), CH2 (CH2_J2.16)
CH2_MOSI: PIC32MZ (U3.62), CH2 (CH2_J2.17)
CH2_SCL: PIC32MZ (U3.85), CH2 (CH2_J2.9 CH2_R8.1)
CH2_SCLK: PIC32MZ (U3.70), CH2 (CH2_J2.15)
CH3_CS1: PIC32MZ (U3.60), CH3 (CH3_J2.1)
CH3_CS2: PIC32MZ (U3.59), CH3 (CH3_J2.2)
CH3_CS3: PIC32MZ (U3.58), CH3 (CH3_J2.3)
CH3_CS4: PIC32MZ (U3.56), CH3 (CH3_J2.4)
CH3_Enable: PIC32MZ (U3.40), CH3 (CH3_U9.6)
CH3_INT1: PIC32MZ (U3.53), CH3 (CH3_J2.5)
CH3_INT2: PIC32MZ (U3.52), CH3 (CH3_J2.6)
CH3_INT3: PIC32MZ (U3.51), CH3 (CH3_J2.7)
CH3_INT4: PIC32MZ (U3.50), CH3 (CH3_J2.8)
CH3_MISO: PIC32MZ (U3.49), CH3 (CH3_J2.16)
CH3_MOSI: PIC32MZ (U3.48), CH3 (CH3_J2.17)
CH3_SCL: PIC32MZ (U3.91), CH3 (CH3_J2.9 CH3_R8.1)
CH3_SCLK: PIC32MZ (U3.61), CH3 (CH3_J2.15)
CH4_CS1: PIC32MZ (U3.45), CH4 (CH4_J2.1)
CH4_CS2: PIC32MZ (U3.44), CH4 (CH4_J2.2)
CH4_CS3: PIC32MZ (U3.43), CH4 (CH4_J2.3)
CH4_CS4: PIC32MZ (U3.39), CH4 (CH4_J2.4)
CH4_Enable: PIC32MZ (U3.38), CH4 (CH4_U9.6)
CH4_INT1: PIC32MZ (U3.46), CH4 (CH4_J2.5)
CH4_INT2: PIC32MZ (U3.47), CH4 (CH4_J2.6)
CH4_INT3: PIC32MZ (U3.30), CH4 (CH4_J2.7)
CH4_INT4: PIC32MZ (U3.34), CH4 (CH4_J2.8)
CH4_MISO: PIC32MZ (U3.25), CH4 (CH4_J2.16)
CH4_MOSI: PIC32MZ (U3.31), CH4 (CH4_J2.17)
CH4_SCL: PIC32MZ (U3.95), CH4 (CH4_J2.9 CH4_R8.1)
CH4_SCLK: PIC32MZ (U3.57), CH4 (CH4_J2.15)
CH5_CS1: PIC32MZ (U3.29), CH5 (CH5_J2.1)
CH5_CS2: PIC32MZ (U3.28), CH5 (CH5_J2.2)
CH5_CS3: PIC32MZ (U3.27), CH5 (CH5_J2.3)
CH5_CS4: PIC32MZ (U3.26), CH5 (CH5_J2.4)
CH5_Enable: PIC32MZ (U3.21), CH5 (CH5_U9.6)
CH5_INT1: PIC32MZ (U3.24), CH5 (CH5_J2.5)
CH5_INT2: PIC32MZ (U3.23), CH5 (CH5_J2.6)
CH5_INT3: PIC32MZ (U3.22), CH5 (CH5_J2.7)
CH5_INT4: PIC32MZ (U3.19), CH5 (CH5_J2.8)
CH5_MISO: PIC32MZ (U3.13), CH5 (CH5_J2.16)
CH5_MOSI: PIC32MZ (U3.6), CH5 (CH5_J2.17)
CH5_SCL: PIC32MZ (U3.16), CH5 (CH5_J2.9 CH5_R8.1)
CH5_SCLK: PIC32MZ (U3.14), CH5 (CH5_J2.15)
CTS: PIC32MZ (U3.118), Host (J1.7)
D_N: PIC32MZ (U3.76), Host (J1.11)
D_P: PIC32MZ (U3.77), Host (J1.12)
Debug: PIC32MZ (U3.125), Host (J1.4)
EEPROM SCL: PIC32MZ (U3.106), EEPROM (R4.1 U4.6)
GPIO 1: PIC32MZ (U3.121), Host (J1.10)
GPIO 2: PIC32MZ (U3.126), Host (J1.9)
Haptic SCL: PIC32MZ (U3.11), Haptic (R6.1 U8.C1)
LEDs Enable: PIC32MZ (U3.113), LEDs (U7.6)
MCLR: PIC32MZ (R1.1 U3.20), Host (J1.1)
PGEC: PIC32MZ (U3.35), Host (J1.2)
PGED: PIC32MZ (U3.36), Host (J1.3)
RGB: PIC32MZ (U3.111), CH1 (CH1_U9.3), LEDs (U7.3), CH2 (CH2_U9.3), CH3 (CH3_U9.3), CH4 (CH4_U9.3), CH5 (CH5_U9.3)
RTS: PIC32MZ (U3.119), Host (J1.8)
RX: PIC32MZ (U3.127), Host (J1.6)
TX: PIC32MZ (U3.128), Host (J1.5)
VBUS: PIC32MZ (R2.1 R3.2 U3.73), Host (J1.13)